# Altium project Battman.PrjPcb (part 2 of 2)

## Sheet RTCC.SchDoc
size A; SheetNumber: 10
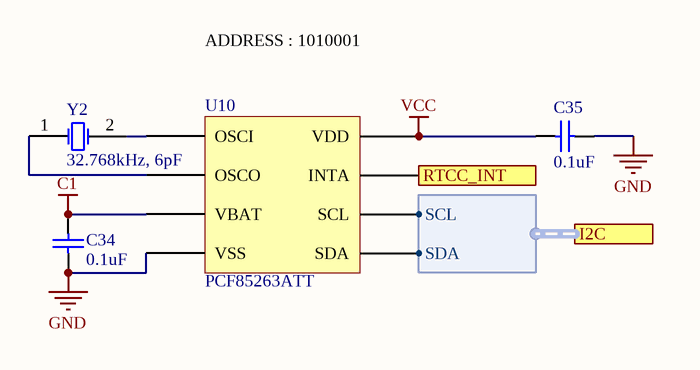
[diagram p5: RTCC.SchDoc]

### Parts
C34  value 0.1uF  [C0603[1608X92]]  (hidden comment: 0.1uF 6.3V 0603)
C35  value 0.1uF  [C0603[1608X92]]  (hidden comment: 0.1uF 6.3V 0603)
U10  PCF85263ATT  [TSSOP-8]
Y2  32.768kHz, 6pF  [ST3215SB]

### Ports
I2C (harness I2C), RTCC_INT (out)

### Harnesses
I2C: SCL, SDA

### Nets
C1: C34.2 U10.3(VBAT)
GND: C34.1 C35.2 U10.4(VSS)
VCC: C35.1 U10.8(VDD)
I2C_SYS.SCL: U10.6(SCL) ; port I2C.SCL
I2C_SYS.SDA: U10.5(SDA) ; port I2C.SDA
RTCC_INT: U10.7(INTA) ; port RTCC_INT
NetU10_1: U10.1(OSCI) Y2.2(X2)
NetU10_2: U10.2(OSCO) Y2.1(X1)

### Notes on the sheet
- ADDRESS : 1010001

### Library data of the parts
C34 C35 = CAP_0.1uF_6.3V_0603_10%: 0.1uF 6.3V 10% 0603 (1608 Metric); PartNumber: GRM188R70J104KA01D; Manufacturer: Murata; Mounting Technology: Surface Mount; PackageReference: 0603; PackageDescription: 0603 (1608 Metric); Voltage: 6.3V; Tolerance: 10%
U10 = PCF85263ATT: Real Time Clock Real-Time Clock calendar; PartNumber: PCF85263ATT/AJ; Manufacturer: Texas Instruments; Mounting Technology: Surface Mount; PackageReference: TSSOP-8
Y2 = ST3215SB32768B0HPWB3: 32.768kHz ±20ppm Crystal 6pF 60 kOhm -40°C ~ 85°C Surface Mount 2-SMD, No Lead (DFN, LCC); Manufacturer: AVX/Kyocera; PackageDescription: 2-SMD, No Lead (DFN, LCC); PackageReference: ST3215SB; Mounting Technology: Surface Mount; PartNumber: ST3215SB32768B0HPWB3

## Sheet Charging.SchDoc
size A; SheetNumber: 6
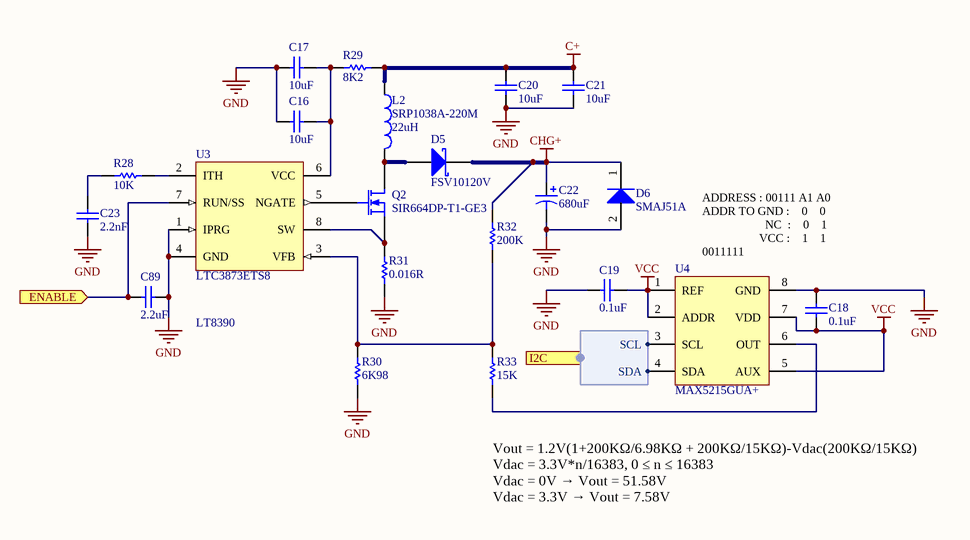
[diagram p6: Charging.SchDoc]

### Parts
(Parts that share a designator on the sheet are numbered #1, #2 ... from top to bottom, then left to right.)
C16  value 10uF  [C0603[1608X92]]  (hidden comment: 10uF 16V 0603)
C17  value 10uF  [C0603[1608X92]]  (hidden comment: 10uF 16V 0603)
C18  value 0.1uF  [C0603[1608X92]]  (hidden comment: 0.1uF 6.3V 0603)
C19  value 0.1uF  [C0603[1608X92]]  (hidden comment: 0.1uF 6.3V 0603)
C20#2  value 10uF  [C1206[3216X160]]  (hidden comment: 10uF 50V 1206)
C21#2  value 10uF  [C1206[3216X160]]  (hidden comment: 10uF 50V 1206)
C22  value 680uF  [CAP-ELECTROLYTIC[10.0x12.6]]  (hidden comment: 180uF 50V)
C23  value 2.2nF  [C0603[1608X92]]  (hidden comment: 2.2nF 50V 0603)
C89  value 2.2uF  [C0603[1608X92]]  (hidden comment: 2.2uF 10V 0603)
D5  FSV10120V  [TO-277]
D6  SMAJ51A  [DO-214AC]
L2  SRP1038A-220M  value 22uH  [SRP1038A]
Q2  SIR664DP-T1-GE3  [PowerPak-8]
R28  value 10K  [R0603[1608]]  (hidden comment: 10K 1% 0603)
R29  value 8K2  [R0603[1608]]  (hidden comment: 8K2 1% 0603)
R30  value 6K98  [R0603[1608]]  (hidden comment: 6K98 1% 0603)
R31  value 0.016R  [R1206[3216]]  (hidden comment: 0.016R 1% 1206)
R32  value 200K  [R0603[1608]]  (hidden comment: 200K 1% 0603)
R33  value 15K  [R0603[1608]]  (hidden comment: 15K 1% 0603)
U3  LTC3873ETS8  [SOT-23-8]
U4  MAX5215GUA+  [MSOP-8]

### Ports
ENABLE (in), I2C (harness I2C)

### Harnesses
I2C: SCL, SDA

### Nets
C+: C20#2.2 C21#2.2 L2.1 R29.2
CHG+: C22.1 D5.1(K) D6.1(K) R32.2
GND: C16.1 C17.1 C18.1 C19.2 C20#2.1 C21#2.1 C22.2 C23.1 C89.2 D6.2(A) R30.1 R31.1 U3.1(IPRG) U3.4(GND) U4.8(GND)
VCC: C18.2 C19.1 U4.1(REF) U4.2(ADDR) U4.5(AUX) U4.7(VDD)
BOOST: C89.1 U3.7(RUN/SS) ; port ENABLE
I2C_SYS.SCL: U4.3(SCL) ; port I2C.SCL
I2C_SYS.SDA: U4.4(SDA) ; port I2C.SDA
NetC16_2: C16.2 C17.2 R29.1 U3.6(VCC)
NetC23_2: C23.2 R28.1
NetD5_2: D5.2(A) L2.2 Q2.3(D)
NetQ2_1: Q2.1(S) R31.2 U3.8(SW)
NetQ2_2: Q2.2(G) U3.5(NGATE)
NetR28_2: R28.2 U3.2(ITH)
NetR30_2: R30.2 R32.1 R33.2 U3.3(VFB)
NetR33_1: R33.1 U4.6(OUT)

### Notes on the sheet
- ADDRESS : 00111 A1 A0
  ADDR TO GND :    0    0
  NC  :    0    1
  VCC :    1    1
  0011111
- LT8390
- Vout = 1.2V(1+200KΩ/6.98KΩ + 200KΩ/15KΩ)-Vdac(200KΩ/15KΩ)
  Vdac = 3.3V*n/16383, 0 ≤ n ≤ 16383
  Vdac = 0V → Vout = 51.58V
  Vdac = 3.3V → Vout = 7.58V

### Library data of the parts
C16 C17 = CAP_10uF_16V_0603_10%: 10uF 16V 10% 0603 (1608 Metric); PartNumber: GRM188R61C106KAALD; Manufacturer: Murata; TemperatureCoefficient: X5R; Mounting Technology: Surface Mount; PackageReference: 0603; PackageDescription: 0603 (1608 Metric); Voltage: 16V; Tolerance: 10%
C18 C19 = CAP_0.1uF_6.3V_0603_10%: as C34 on sheet RTCC; Mounting Technology: Surface Mount; PackageReference: 0603; PackageDescription: 0603 (1608 Metric); Voltage: 6.3V; Tolerance: 10%
C20#2 C21#2 = CAP_10uF_50V_1206_20%: 10uF 50V 20% 1206 (3216 Metric); PartNumber: UMK316BBJ106ML-T; Manufacturer: Taiyo Yuden; Tolerance: 20%; Mounting Technology: Surface Mount; PackageReference: 1206; PackageDescription: 1206 (3216 Metric); Voltage: 50V
C22 = CAP_180uF_50V_20%: 180uF 50V 20%; PartNumber: PCR1H181MCL1GS; Manufacturer: Nichicon; PackageReference: 1H; PackageDescription: 5mm; Mounting Technology: Surface Mount; Voltage: 50V; Tolerance: 20%
C23 = CAP_2.2nF_50V_0603_5%: 2.2nF 50V 5% 0603 (1608 Metric); PartNumber: GRM1885C1H222JA01D; Manufacturer: Murata; TemperatureCoefficient: C0G; Mounting Technology: Surface Mount; PackageReference: 0603; PackageDescription: 0603 (1608 Metric); Voltage: 50V; Tolerance: 5%
C89 = CAP_2.2uF_10V_0603_10%: 2.2uF 10V 10% 0603 (1608 Metric); PartNumber: GRT188R61A225KE13D; Manufacturer: Murata; TemperatureCoefficient: X5R; Mounting Technology: Surface Mount; PackageReference: 0603; PackageDescription: 0603 (1608 Metric); Voltage: 10V; Tolerance: 10%
D5 = FSV10120V: Schottky Diodes & Rectifiers 10 Amp 120V Schottky Rectifier; Manufacturer: Fairchild Semiconductor; PackageReference: TO-277-3; PartNumber: FSV10120V; Mounting Technology: Surface Mount
D6 = SMAJ51A-E3/61: Manufacturer: Vishay; PartNumber: SMAJ51A-E3/61; PackageReference: DO-214AC; PackageDescription: DO-214AC, 2 Leads; Mounting Technology: Surface Mount
L2 = SRP1038A-220M: 22uH 20% 7A 1038; Manufacturer: Bourns; PackageReference: SRP1038A; PartNumber: SRP1038A-220M; Mounting Technology: Surface Mount; Current: 7A
Q2 = SIR664DP-T1-GE3: N-Channel MOSFET; Manufacturer: Vishay; PartNumber: SIR664DP-T1-GE3; Mounting Technology: Surface Mount; PackageReference: PowerPAK-8
R28 = RES_10K_0603_1%: 10K 0.25W 1% 0603 (1005 Metric); Manufacturer: Vishay / Dale; PartNumber: CRCW060310K0FKEAHP; Tolerance: 1%; Power: 0.25W; Mounting Technology: Surface Mount; PackageReference: 0603; PackageDescription: 0603 (1608 Metric); ComponentLink1Description: Datasheet; ComponentLink1URL: http://www.vishay.com/docs/20065/rcse3.pdf
R29 = RES_8K2_0603_1%: 8K2 0.25W 1% 0603 (1005 Metric); Manufacturer: Vishay; PartNumber: CRCW06038K20FKEAHP; Tolerance: 1%; Power: 0.25W; Mounting Technology: Surface Mount; PackageReference: 0603; PackageDescription: 0603 (1608 Metric); ComponentLink1Description: Datasheet; ComponentLink1URL: http://www.vishay.com/docs/20043/crcwhpe3.pdf
R30 = RES_6K98_0603_1%: 6K98 0.25W 1% 0603 (1005 Metric); Manufacturer: Vishay / Dale; PartNumber: CRCW06036K98FKEAHP; Tolerance: 1%; Power: 0.25W; Mounting Technology: Surface Mount; PackageReference: 0603; PackageDescription: 0603 (1608 Metric); ComponentLink1Description: Datasheet; ComponentLink1URL: http://www.vishay.com/docs/20043/crcwhpe3.pdf
R31 = RES_0.016R_1206_1%: 0.016R 1W 1% 1206 (3216 Metric); Manufacturer: Panasonic; PartNumber: ERJ-8CWFR016V; Power: 1W; Tolerance: 1%; Mounting Technology: Surface Mount; PackageReference: 1206; PackageDescription: 1206 (3216 Metric); ComponentLink1Description: Datasheet; ComponentLink1URL: https://industrial.panasonic.com/cdbs/www-data/pdf/RDA0000/AOA0000C239.pdf
R32 = RES_200K_0603_1%: 200K 0.25W 1% 0603 (1005 Metric); Manufacturer: Rohm Semiconductor; PartNumber: ESR03EZPJ204; Tolerance: 5%; Power: 0.25W; Mounting Technology: Surface Mount; PackageReference: 0603; PackageDescription: 0603 (1608 Metric); ComponentLink1Description: Datasheet; ComponentLink1URL: http://www.vishay.com/docs/20043/crcwhpe3.pdf
R33 = RES_15K_0603_1%: 15K 0.25W 1% 0603 (1005 Metric); Manufacturer: Vishay / Dale; PartNumber: CRCW060315K0FKEAHP; Tolerance: 1%; Power: 0.25W; Mounting Technology: Surface Mount; PackageReference: 0603; PackageDescription: 0603 (1608 Metric); ComponentLink1Description: Datasheet; ComponentLink1URL: http://www.vishay.com/docs/20043/crcwhpe3.pdf
U3 = LTC3873ETS8: PartNumber: LTC3873ETS8#PBF; Manufacturer: Linear Technology; PackageReference: TSOT-23-8; Mounting Technology: Surface Mount
U4 = MAX5215GUA+: 14 Bit Digital to Analog Converter; Manufacturer: Maxim Integrated; PartNumber: MAX5215GUA+; Mounting Technology: Surface Mount; PackageReference: MSOP-8

## Sheet CurrentSense.SchDoc
size A; SheetNumber: 8
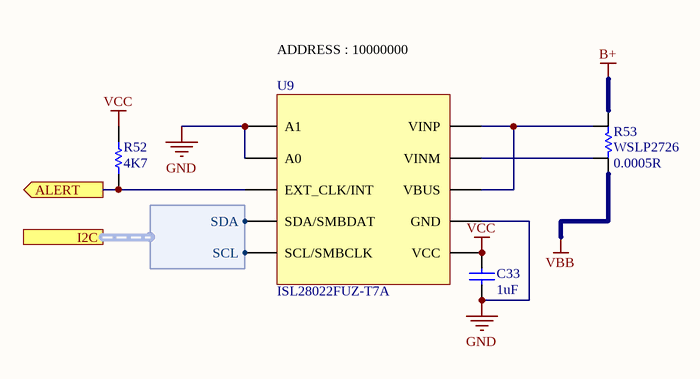
[diagram p7: CurrentSense.SchDoc]

### Parts
C33  value 1uF  [C0603[1608X92]]  (hidden comment: 1uF 6.3V 0603)
R52  value 4K7  [R0603[1608]]  (hidden comment: 4K7 1% 0603)
R53  WSLP2726  value 0.0005R  [WSL2726]
U9  ISL28022FUZ-T7A  [MSOP-10]

### Ports
ALERT (out), I2C (harness I2C)

### Harnesses
I2C: SCL, SDA

### Nets
B+: R53.2
GND: C33.1 U9.1(A1) U9.2(A0) U9.7(GND)
VBB: R53.1
VCC: C33.2 R52.2 U9.6(VCC)
ALERT: R52.1 U9.3(EXT_CLK/INT) ; port ALERT
I2C_SYS.SCL: U9.5(SCL/SMBCLK) ; port I2C.SCL
I2C_SYS.SDA: U9.4(SDA/SMBDAT) ; port I2C.SDA
NetR53_3: R53.3 U9.9(VINM)
NetR53_4: R53.4 U9.8(VBUS) U9.10(VINP)

### Notes on the sheet
- ADDRESS : 10000000

### Library data of the parts
C33 = CAP_1uF_6.3V_0603_10%: 1uF 6.3V 10% 0603 (1608 Metric); PartNumber: GRM188R60J105KA01D; Manufacturer: Murata; TemperatureCoefficient: X5R; Mounting Technology: Surface Mount; PackageReference: 0603; PackageDescription: 0603 (1608 Metric); Voltage: 6.3V; Tolerance: 10%
R52 = RES_4K7_0603_1%: 4K7 0.25W 1% 0603 (1005 Metric); Manufacturer: Vishay / Dale; PartNumber: CRCW06034K70FKEAHP; Tolerance: 1%; Power: 0.25W; Mounting Technology: Surface Mount; PackageReference: 0603; PackageDescription: 0603 (1608 Metric); ComponentLink1Description: Datasheet; ComponentLink1URL: http://www.vishay.com/docs/20043/crcwhpe3.pdf
R53 = WSLP2726: Current Sense Resistor, 0.0005R; PartNumber: WSLP2726L5000FEA; Manufacturer: Vishay / Dale; Power: 7W; Tolerance: 1%; PackageReference: 2726; Mounting Technology: Surface Mount
U9 = ISL28022FUZ-T7A: Manufacturer: Intersil; PartNumber: ISL28022FUZ-T7A; Mounting Technology: Surface Mount; PackageReference: MSOP-10

## Sheet LTC6803.SchDoc
size A; SheetNumber: 4
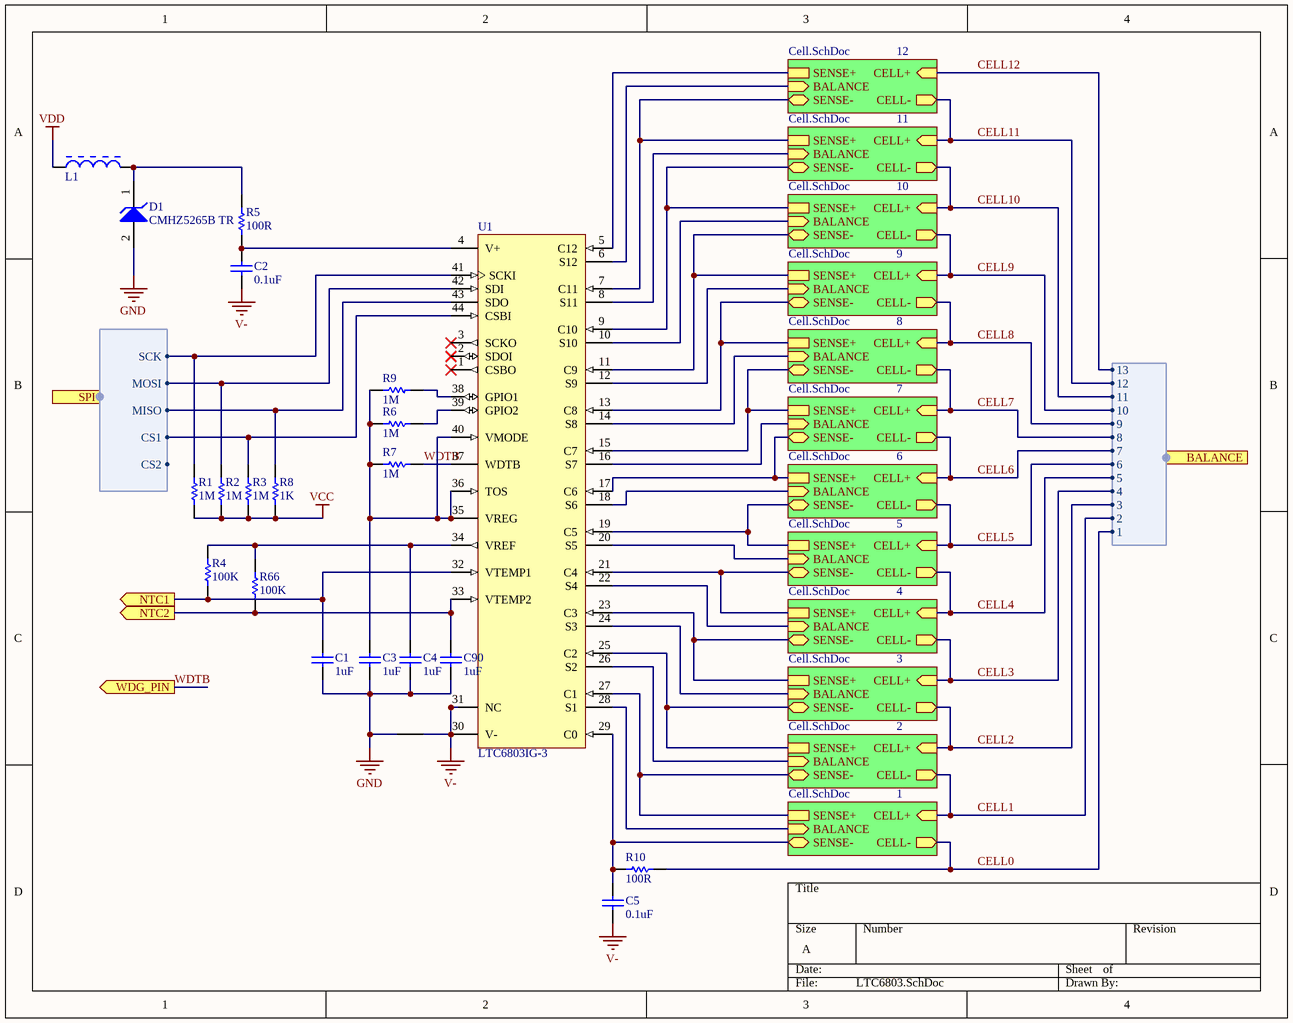
[diagram p8: LTC6803.SchDoc]

### Parts
*  NetTie  [NetTie]  (value not drawn)  (net tie, no BOM)
C1  value 1uF  [C0603[1608X92]]  (hidden comment: 1uF 6.3V 0603)
C2  value 0.1uF  [C0603[1608X92]]  (hidden comment: 0.1uF 100V 0603)
C3  value 1uF  [C0603[1608X92]]  (hidden comment: 1uF 6.3V 0603)
C4  value 1uF  [C0603[1608X92]]  (hidden comment: 1uF 6.3V 0603)
C5  value 0.1uF  [C0603[1608X92]]  (hidden comment: 0.1uF 6.3V 0603)
C90  value 1uF  [C0603[1608X92]]  (hidden comment: 1uF 6.3V 0603)
D1  CMHZ5265B TR  [SOD-123]
L1  MURA-FB-2  [MURA-BLM31-B60-CHIP-2_V3]  (value not drawn)
R1  value 1M  [R0603[1608]]  (hidden comment: 1M 5% 0603)
R2  value 1M  [R0603[1608]]  (hidden comment: 1M 5% 0603)
R3  value 1M  [R0603[1608]]  (hidden comment: 1M 5% 0603)
R4  value 100K  [R0603[1608]]  (hidden comment: 100K 1% 0603)
R5  value 100R  [R0603[1608]]  (hidden comment: 100R 1% 0603)
R6  value 1M  [R0603[1608]]  (hidden comment: 1M 5% 0603)
R7  value 1M  [R0603[1608]]  (hidden comment: 1M 5% 0603)
R8  value 1K  [R0603[1608]]  (hidden comment: 1K 1% 0603)
R9  value 1M  [R0603[1608]]  (hidden comment: 1M 5% 0603)
R10  value 100R  [R0603[1608]]  (hidden comment: 100R 1% 0603)
R66  value 100K  [R0603[1608]]  (hidden comment: 100K 1% 0603)
U1  LTC6803IG-3  [TSSOP-44]

### Sub-sheets
1 = Cell.SchDoc: SENSE+, SENSE- (bidir), BALANCE (in), CELL+ (in), CELL- (out)
2 = Cell.SchDoc: SENSE+, SENSE- (bidir), BALANCE (in), CELL+ (in), CELL- (out)
3 = Cell.SchDoc: SENSE+, SENSE- (bidir), BALANCE (in), CELL+ (in), CELL- (out)
4 = Cell.SchDoc: SENSE+, SENSE- (bidir), BALANCE (in), CELL+ (in), CELL- (out)
5 = Cell.SchDoc: SENSE+, SENSE- (bidir), BALANCE (in), CELL+ (in), CELL- (out)
6 = Cell.SchDoc: SENSE+, SENSE- (bidir), BALANCE (in), CELL+ (in), CELL- (out)
7 = Cell.SchDoc: SENSE+, SENSE- (bidir), BALANCE (in), CELL+ (in), CELL- (out)
8 = Cell.SchDoc: SENSE+, SENSE- (bidir), BALANCE (in), CELL+ (in), CELL- (out)
9 = Cell.SchDoc: SENSE+, SENSE- (bidir), BALANCE (in), CELL+ (in), CELL- (out)
10 = Cell.SchDoc: SENSE+, SENSE- (bidir), BALANCE (in), CELL+ (in), CELL- (out)
11 = Cell.SchDoc: SENSE+, SENSE- (bidir), BALANCE (in), CELL+ (in), CELL- (out)
12 = Cell.SchDoc: SENSE+, SENSE- (bidir), BALANCE (in), CELL+ (in), CELL- (out)

### Ports
BALANCE (harness Balance), NTC1 (out), NTC2 (out), SPI (harness SPI), WDG_PIN (out)

### Harnesses
SPI: SCK, MOSI, MISO, CS1, CS2
Balance: 13, 12, 11, 10, 9, 8, 6, 7, 5, 3, 4, 2, 1

### Nets
GND: *.1 C1.1 C3.1 C4.1 C90.1 D1.2(A)
V-: *.2 C2.1 C5.1 U1.30(V-) U1.31(NC)
VCC: R1.1 R2.1 R3.1 R8.1
VDD: L1.1
CELL0: R10.1 ; sheet 1/CELL-, port BALANCE.1
CELL1: sheet 2/CELL-, sheet 1/CELL+, port BALANCE.2
CELL2: sheet 3/CELL-, sheet 2/CELL+, port BALANCE.3
CELL3: sheet 4/CELL-, sheet 3/CELL+, port BALANCE.4
CELL4: sheet 5/CELL-, sheet 4/CELL+, port BALANCE.5
CELL5: sheet 6/CELL-, sheet 5/CELL+, port BALANCE.6
CELL6: sheet 7/CELL-, sheet 6/CELL+, port BALANCE.7
CELL7: sheet 8/CELL-, sheet 7/CELL+, port BALANCE.8
CELL8: sheet 9/CELL-, sheet 8/CELL+, port BALANCE.9
CELL9: sheet 10/CELL-, sheet 9/CELL+, port BALANCE.10
CELL10: sheet 11/CELL-, sheet 10/CELL+, port BALANCE.11
CELL11: sheet 12/CELL-, sheet 11/CELL+, port BALANCE.12
CELL12: sheet 12/CELL+, port BALANCE.13
SPI_SYS.CS1: R3.2 U1.44(CSBI) ; port SPI.CS1
SPI_SYS.MISO: R8.2 U1.43(SDO) ; port SPI.MISO
SPI_SYS.MOSI: R2.2 U1.42(SDI) ; port SPI.MOSI
SPI_SYS.SCK: R1.2 U1.41(SCKI) ; port SPI.SCK
WDTB: R7.1 U1.37(WDTB) ; port WDG_PIN
NetC1_2: C1.2 R4.1 U1.32(VTEMP1) ; port NTC1
NetC2_2: C2.2 R5.1 U1.4(V+)
NetC3_2: C3.2 R6.2 R7.2 R9.2 U1.35(VREG) U1.36(TOS) U1.40(VMODE)
NetC4_2: C4.2 R4.2 R66.2 U1.34(VREF)
NetC5_2: C5.2 R10.2 U1.29(C0) ; sheet 1/SENSE-
NetC23_1_2: U1.27(C1) ; sheet 2/SENSE-, sheet 1/SENSE+
NetC23_2_2: U1.25(C2) ; sheet 3/SENSE-, sheet 2/SENSE+
NetC23_3_2: U1.23(C3) ; sheet 4/SENSE-, sheet 3/SENSE+
NetC23_4_2: U1.21(C4) ; sheet 5/SENSE-, sheet 4/SENSE+
NetC23_5_2: U1.19(C5) ; sheet 6/SENSE-, sheet 5/SENSE+
NetC23_6_2: U1.17(C6) ; sheet 7/SENSE-, sheet 6/SENSE+
NetC23_7_2: U1.15(C7) ; sheet 8/SENSE-, sheet 7/SENSE+
NetC23_8_2: U1.13(C8) ; sheet 9/SENSE-, sheet 8/SENSE+
NetC23_9_2: U1.11(C9) ; sheet 10/SENSE-, sheet 9/SENSE+
NetC23_10_2: U1.9(C10) ; sheet 11/SENSE-, sheet 10/SENSE+
NetC23_11_2: U1.7(C11) ; sheet 12/SENSE-, sheet 11/SENSE+
NetC23_12_2: U1.5(C12) ; sheet 12/SENSE+
NetC90_2: C90.2 R66.1 U1.33(VTEMP2) ; port NTC2
NetD1_1: D1.1(K) L1.2 R5.2
NetQ3_1_1: U1.28(S1) ; sheet 1/BALANCE
NetQ3_2_1: U1.26(S2) ; sheet 2/BALANCE
NetQ3_3_1: U1.24(S3) ; sheet 3/BALANCE
NetQ3_4_1: U1.22(S4) ; sheet 4/BALANCE
NetQ3_5_1: U1.20(S5) ; sheet 5/BALANCE
NetQ3_6_1: U1.18(S6) ; sheet 6/BALANCE
NetQ3_7_1: U1.16(S7) ; sheet 7/BALANCE
NetQ3_8_1: U1.14(S8) ; sheet 8/BALANCE
NetQ3_9_1: U1.12(S9) ; sheet 9/BALANCE
NetQ3_10_1: U1.10(S10) ; sheet 10/BALANCE
NetQ3_11_1: U1.8(S11) ; sheet 11/BALANCE
NetQ3_12_1: U1.6(S12) ; sheet 12/BALANCE
NetR6_1: R6.1 U1.39(GPIO2)
NetR9_1: R9.1 U1.38(GPIO1)

Not connected (* = marked no-connect by the designer): U1 1(CSBO)* 2(SDOI)* 3(SCKO)*

### Library data of the parts
C1 C3 C4 C90 = CAP_1uF_6.3V_0603_10%: as C33 on sheet CurrentSense; Mounting Technology: Surface Mount; PackageReference: 0603; PackageDescription: 0603 (1608 Metric); Voltage: 6.3V; Tolerance: 10%
C2 = CAP_0.1uF_100V_0603_10%: as C38 on sheet Switches; Mounting Technology: Surface Mount; PackageReference: 0603; PackageDescription: 0603 (1608 Metric); Voltage: 100V; Tolerance: 10%
C5 = CAP_0.1uF_6.3V_0603_10%: as C34 on sheet RTCC; Mounting Technology: Surface Mount; PackageReference: 0603; PackageDescription: 0603 (1608 Metric); Voltage: 6.3V; Tolerance: 10%
D1 = CMHZ5265B: Zener Diodes 500mW Zener Diode 185mA 58.9V to 2V; Manufacturer: Central Semiconductor; PartNumber: CMHZ5265B; Mounting Technology: Surface Mount; PackageReference: SOD-123; PackageDescription: SOD, 2-Leads, Body 2.69x1.6mm
L1 = MURA-FB-2: EMI Filter Beads, Chips & Arrays 1206 33 OHM; PartNumber: BLM31PG330SN1L; Manufacturer: Murata; Mounting Technology: Surface Mount; PackageReference: 1206; PackageDescription: 1206 (3216 Metric)
R1-R3 R6 R7 R9 = RES_1M_0603_5%: 1M 0.25W 5% 0603 (1005 Metric); Manufacturer: Panasonic; PartNumber: ERJ-PA3J105V; Tolerance: 5%; Power: 0.25W; Mounting Technology: Surface Mount; PackageReference: 0603; PackageDescription: 0603 (1608 Metric); ComponentLink1Description: Datasheet; ComponentLink1URL: http://www.vishay.com/docs/20043/crcwhpe3.pdf
R4 R66 = RES_100K_0603_1%: 100K 0.25W 1% 0603 (1005 Metric); Manufacturer: Vishay / Dale; PartNumber: CRCW0603100KFKEAHP; Tolerance: 1%; Power: 0.25W; Mounting Technology: Surface Mount; PackageReference: 0603; PackageDescription: 0603 (1608 Metric); ComponentLink1Description: Datasheet; ComponentLink1URL: http://www.vishay.com/docs/20043/crcwhpe3.pdf
R5 R10 = RES_100R_0603_1%: as R50 on sheet Switches; Tolerance: 1%; Power: 0.25W; Mounting Technology: Surface Mount; PackageReference: 0603; PackageDescription: 0603 (1608 Metric); ComponentLink1Description: Datasheet; ComponentLink1URL: http://www.vishay.com/docs/20043/crcwhpe3.pdf
R8 = RES_1K_0603_1%: 1K 0.25W 1% 0603 (1005 Metric); Manufacturer: Vishay / Dale; PartNumber: CRCW06031K00FKEAHP; Tolerance: 1%; Power: 0.25W; Mounting Technology: Surface Mount; PackageReference: 0603; PackageDescription: 0603 (1608 Metric); ComponentLink1Description: Datasheet; ComponentLink1URL: http://www.vishay.com/docs/20043/crcwhpe3.pdf
U1 = LTC6803IG-3: PartNumber: LTC6803IG-3#PBF; Manufacturer: Linear Technology; PackageReference: TSSOP-44; Mounting Technology: Surface Mount; PackageDescription: SOP, 44-Leads, Body 13.1x5.6mm, Pitch 0.5mm

## Sheet Cell.SchDoc
size A; SheetNumber: 5
Used 12 times, as channels U_LTC6803/12, U_LTC6803/11, U_LTC6803/10, U_LTC6803/9, U_LTC6803/8, U_LTC6803/7, U_LTC6803/6, U_LTC6803/5, U_LTC6803/4, U_LTC6803/3, U_LTC6803/2, U_LTC6803/1. Parts and nets are listed once, with the designators drawn on the sheet.
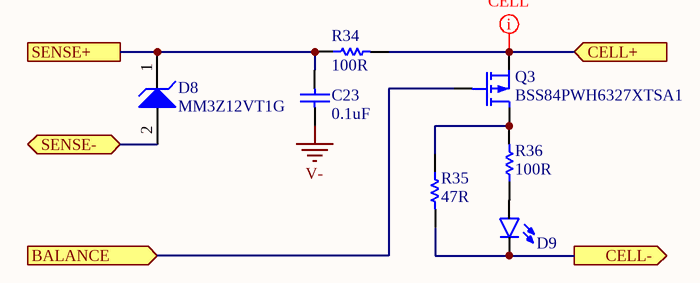
[diagram p9: Cell.SchDoc]

### Parts
C23  value 0.1uF  [C0603[1608X92]]  (hidden comment: 0.1uF 100V 0603)
D8  MM3Z12VT1G  [SOD-323]
D9  LED_0603_BLUE_5mA  [LED0603]  (value not drawn)
Q3  BSS84PWH6327XTSA1  [SOT323-3]
R34  value 100R  [R0603[1608]]  (hidden comment: 100R 1% 0603)
R35  value 47R  [R0805[2012]]  (hidden comment: 47R 5% 0805)
R36  value 100R  [R0603[1608]]  (hidden comment: 100R 1% 0603)

### Ports
BALANCE (in), CELL+ (in), CELL- (out), SENSE+, SENSE- (bidir)

### Nets
V-: C23.1
BALANCE: Q3.1(G) ; port BALANCE
CELL+: Q3.2(S) R34.1 ; port CELL+
CELL-: D9.C R35.1 ; port CELL-
SENSE+: C23.2 D8.1(K) R34.2 ; port SENSE+
SENSE-: D8.2(A) ; port SENSE-
NetD9_A: D9.A R36.2
NetQ3_3: Q3.3(D) R35.2 R36.1

### Channels
U_LTC6803/12: designators end in _12; ports BALANCE=NetQ3_12_1 CELL+=CELL12 CELL-=CELL11 SENSE+=NetC23_12_2 SENSE-=NetC23_11_2
U_LTC6803/11: designators end in _11; ports BALANCE=NetQ3_11_1 CELL+=CELL11 CELL-=CELL10 SENSE+=NetC23_11_2 SENSE-=NetC23_10_2
U_LTC6803/10: designators end in _10; ports BALANCE=NetQ3_10_1 CELL+=CELL10 CELL-=CELL9 SENSE+=NetC23_10_2 SENSE-=NetC23_9_2
U_LTC6803/9: designators end in _9; ports BALANCE=NetQ3_9_1 CELL+=CELL9 CELL-=CELL8 SENSE+=NetC23_9_2 SENSE-=NetC23_8_2
U_LTC6803/8: designators end in _8; ports BALANCE=NetQ3_8_1 CELL+=CELL8 CELL-=CELL7 SENSE+=NetC23_8_2 SENSE-=NetC23_7_2
U_LTC6803/7: designators end in _7; ports BALANCE=NetQ3_7_1 CELL+=CELL7 CELL-=CELL6 SENSE+=NetC23_7_2 SENSE-=NetC23_6_2
U_LTC6803/6: designators end in _6; ports BALANCE=NetQ3_6_1 CELL+=CELL6 CELL-=CELL5 SENSE+=NetC23_6_2 SENSE-=NetC23_5_2
U_LTC6803/5: designators end in _5; ports BALANCE=NetQ3_5_1 CELL+=CELL5 CELL-=CELL4 SENSE+=NetC23_5_2 SENSE-=NetC23_4_2
U_LTC6803/4: designators end in _4; ports BALANCE=NetQ3_4_1 CELL+=CELL4 CELL-=CELL3 SENSE+=NetC23_4_2 SENSE-=NetC23_3_2
U_LTC6803/3: designators end in _3; ports BALANCE=NetQ3_3_1 CELL+=CELL3 CELL-=CELL2 SENSE+=NetC23_3_2 SENSE-=NetC23_2_2
U_LTC6803/2: designators end in _2; ports BALANCE=NetQ3_2_1 CELL+=CELL2 CELL-=CELL1 SENSE+=NetC23_2_2 SENSE-=NetC23_1_2
U_LTC6803/1: designators end in _1; ports BALANCE=NetQ3_1_1 CELL+=CELL1 CELL-=CELL0 SENSE+=NetC23_1_2 SENSE-=NetC5_2

### Layout directives
net class CELL: CELL12

### Library data of the parts
C23 = CAP_0.1uF_100V_0603_10%: 0.1uF 100V 10% 0603 (1608 Metric); PartNumber: GRM188R72A104KA35D; Manufacturer: Murata; TemperatureCoefficient: X7R; Mounting Technology: Surface Mount; PackageReference: 0603; PackageDescription: 0603 (1608 Metric); Voltage: 100V; Tolerance: 10%
D8 = MM3Z12VT1G: Zener Voltage Regulator, 300 mW, 2-Pin SOD-323, Tape and Reel; Manufacturer: ON Semiconductor; Mounting Technology: Surface Mount; PackageDescription: SOD, 2-Leads; PartNumber: MM3Z12VT1G; PackageReference: SOD-323
D9 = LED_0603_BLUE_5mA: PartNumber: LTST-C193TBKT-5A; Manufacturer: Lite-On Inc.; PackageReference: 0603; PackageDescription: 0603 (1608 Metric); Mounting Technology: Surface Mount
Q3 = BSS84PW H6327: P-Channel MOSFET; Manufacturer: Infineon; Mounting Technology: Surface Mount; PartNumber: BSS84PWH6327XTSA1; PackageReference: SOT323-3
R34 R36 = RES_100R_0603_1%: 100R 0.25W 1% 0603 (1005 Metric); Manufacturer: Vishay / Dale; PartNumber: CRCW0603100RFKEAHP; Tolerance: 1%; Power: 0.25W; Mounting Technology: Surface Mount; PackageReference: 0603; PackageDescription: 0603 (1608 Metric); ComponentLink1Description: Datasheet; ComponentLink1URL: http://www.vishay.com/docs/20043/crcwhpe3.pdf
R35 = RES_47R_0805_5%: 47R 0.5W 5% 0805 (2012 Metric); Manufacturer: Panasonic; PartNumber: ERJ-P06J470V; Tolerance: 5%; Power: 0.5W; Mounting Technology: Surface Mount; PackageReference: 0805; PackageDescription: 0805 (2012 Metric); ComponentLink1Description: Datasheet; ComponentLink1URL: https://industrial.panasonic.com/cdbs/www-data/pdf/RDA0000/AOA0000C243.pdf

## Nets that join several sheets
5V: 3V3 (5 pins), Connectors (JPB.1 JPB.3)
B+: Switches (D16.1), CurrentSense (R53.2)
C1: Switches (D18.1 Q9.2 R41.1), Connectors (*1.2), RTCC (C34.2 U10.3)
C+: Switches (R27.2 R38.2), Connectors (JP10.7), Charging (C20#2.2 C21#2.2 L2.1 R29.2)
CHG+: Switches (5 pins), Charging (C22.1 D5.1 D6.1 R32.2)
GND: 3V3 (18 pins), MCU (25 pins), Switches (19 pins), Connectors (19 pins), RTCC (C34.1 C35.2 U10.4), Charging (15 pins), CurrentSense (C33.1 U9.1 U9.2 U9.7), LTC6803 (6 pins)
SWT: Switches (5 pins), Connectors (JP4.1 JP21.1)
V-: LTC6803 (5 pins), U_LTC6803/12 (C23_12.1), U_LTC6803/11 (C23_11.1), U_LTC6803/10 (C23_10.1), U_LTC6803/9 (C23_9.1), U_LTC6803/8 (C23_8.1), U_LTC6803/7 (C23_7.1), U_LTC6803/6 (C23_6.1), U_LTC6803/5 (C23_5.1), U_LTC6803/4 (C23_4.1), U_LTC6803/3 (C23_3.1), U_LTC6803/2 (C23_2.1), U_LTC6803/1 (C23_1.1)
VBB: Switches (8 pins), CurrentSense (R53.1)
VCC: 3V3 (5 pins), MCU (30 pins), Switches (Q15.2 U7.5 U7.7), Connectors (11 pins), RTCC (C35.1 U10.8), Charging (6 pins), CurrentSense (C33.2 R52.2 U9.6), LTC6803 (R1.1 R2.1 R3.1 R8.1)
VDD: 3V3 (5 pins), Switches (Q7.3 R50.1), LTC6803 (L1.1)
VUSB: 3V3 (D11.2 D15.1), MCU (U2.68), Connectors (JP16.VBUS)
ALERT: MCU (U2.36), CurrentSense (R52.1 U9.3)
BOOST: MCU (U2.37), Charging (C89.1 U3.7)
CELL0: Connectors (JP1.1), LTC6803 (R10.1), U_LTC6803/1 (D9_1.C R35_1.1)
CELL1: Connectors (*1.1 JP1.2), U_LTC6803/2 (D9_2.C R35_2.1), U_LTC6803/1 (Q3_1.2 R34_1.1)
CELL2: Connectors (JP1.3), U_LTC6803/3 (D9_3.C R35_3.1), U_LTC6803/2 (Q3_2.2 R34_2.1)
CELL3: Connectors (JP1.4), U_LTC6803/4 (D9_4.C R35_4.1), U_LTC6803/3 (Q3_3.2 R34_3.1)
CELL4: Connectors (JP1.5), U_LTC6803/5 (D9_5.C R35_5.1), U_LTC6803/4 (Q3_4.2 R34_4.1)
CELL5: Connectors (JP1.6), U_LTC6803/6 (D9_6.C R35_6.1), U_LTC6803/5 (Q3_5.2 R34_5.1)
CELL6: Connectors (JP1.7), U_LTC6803/7 (D9_7.C R35_7.1), U_LTC6803/6 (Q3_6.2 R34_6.1)
CELL7: Connectors (JP1.8), U_LTC6803/8 (D9_8.C R35_8.1), U_LTC6803/7 (Q3_7.2 R34_7.1)
CELL8: Connectors (JP1.9), U_LTC6803/9 (D9_9.C R35_9.1), U_LTC6803/8 (Q3_8.2 R34_8.1)
CELL9: Connectors (JP1.10), U_LTC6803/10 (D9_10.C R35_10.1), U_LTC6803/9 (Q3_9.2 R34_9.1)
CELL10: Connectors (JP1.11), U_LTC6803/11 (D9_11.C R35_11.1), U_LTC6803/10 (Q3_10.2 R34_10.1)
CELL11: Connectors (JP1.12), U_LTC6803/12 (D9_12.C R35_12.1), U_LTC6803/11 (Q3_11.2 R34_11.1)
CELL12: Connectors (JP1.13), U_LTC6803/12 (Q3_12.2 R34_12.1)
I2C_SYS.SCL: RTCC (U10.6), Charging (U4.3), CurrentSense (U9.5)
I2C_SYS.SDA: RTCC (U10.5), Charging (U4.4), CurrentSense (U9.4)
IO_IRQ: MCU (U2.9), Connectors (JP13.6)
IO_RST: MCU (U2.8), Connectors (JP13.7)
LED_STRIP_L: MCU (U2.23), Connectors (JP13.3)
LED_STRIP_R: MCU (U2.22), Connectors (JP13.4)
MPU_INT1: MCU (U2.96), Connectors (JP13.11)
MPU_INT2: MCU (U2.95), Connectors (JP13.12)
NetC1_2: Connectors (JP2.4), LTC6803 (C1.2 R4.1 U1.32)
NetC5_2: LTC6803 (C5.2 R10.2 U1.29), U_LTC6803/1 (D8_1.2)
NetC23_1_2: LTC6803 (U1.27), U_LTC6803/2 (D8_2.2), U_LTC6803/1 (C23_1.2 D8_1.1 R34_1.2)
NetC23_2_2: LTC6803 (U1.25), U_LTC6803/3 (D8_3.2), U_LTC6803/2 (C23_2.2 D8_2.1 R34_2.2)
NetC23_3_2: LTC6803 (U1.23), U_LTC6803/4 (D8_4.2), U_LTC6803/3 (C23_3.2 D8_3.1 R34_3.2)
NetC23_4_2: LTC6803 (U1.21), U_LTC6803/5 (D8_5.2), U_LTC6803/4 (C23_4.2 D8_4.1 R34_4.2)
NetC23_5_2: LTC6803 (U1.19), U_LTC6803/6 (D8_6.2), U_LTC6803/5 (C23_5.2 D8_5.1 R34_5.2)
NetC23_6_2: LTC6803 (U1.17), U_LTC6803/7 (D8_7.2), U_LTC6803/6 (C23_6.2 D8_6.1 R34_6.2)
NetC23_7_2: LTC6803 (U1.15), U_LTC6803/8 (D8_8.2), U_LTC6803/7 (C23_7.2 D8_7.1 R34_7.2)
NetC23_8_2: LTC6803 (U1.13), U_LTC6803/9 (D8_9.2), U_LTC6803/8 (C23_8.2 D8_8.1 R34_8.2)
NetC23_9_2: LTC6803 (U1.11), U_LTC6803/10 (D8_10.2), U_LTC6803/9 (C23_9.2 D8_9.1 R34_9.2)
NetC23_10_2: LTC6803 (U1.9), U_LTC6803/11 (D8_11.2), U_LTC6803/10 (C23_10.2 D8_10.1 R34_10.2)
NetC23_11_2: LTC6803 (U1.7), U_LTC6803/12 (D8_12.2), U_LTC6803/11 (C23_11.2 D8_11.1 R34_11.2)
NetC23_12_2: LTC6803 (U1.5), U_LTC6803/12 (C23_12.2 D8_12.1 R34_12.2)
NetC90_2: Connectors (JP2.3), LTC6803 (C90.2 R66.1 U1.33)
NetJP4_2: Switches (R46.2), Connectors (JP4.2)
NetQ1_1: MCU (Q1.1), Switches (Q12.1 R46.1 R47.2)
NetQ3_1_1: LTC6803 (U1.28), U_LTC6803/1 (Q3_1.1)
NetQ3_2_1: LTC6803 (U1.26), U_LTC6803/2 (Q3_2.1)
NetQ3_3_1: LTC6803 (U1.24), U_LTC6803/3 (Q3_3.1)
NetQ3_4_1: LTC6803 (U1.22), U_LTC6803/4 (Q3_4.1)
NetQ3_5_1: LTC6803 (U1.20), U_LTC6803/5 (Q3_5.1)
NetQ3_6_1: LTC6803 (U1.18), U_LTC6803/6 (Q3_6.1)
NetQ3_7_1: LTC6803 (U1.16), U_LTC6803/7 (Q3_7.1)
NetQ3_8_1: LTC6803 (U1.14), U_LTC6803/8 (Q3_8.1)
NetQ3_9_1: LTC6803 (U1.12), U_LTC6803/9 (Q3_9.1)
NetQ3_10_1: LTC6803 (U1.10), U_LTC6803/10 (Q3_10.1)
NetQ3_11_1: LTC6803 (U1.8), U_LTC6803/11 (Q3_11.1)
NetQ3_12_1: LTC6803 (U1.6), U_LTC6803/12 (Q3_12.1)
NetR22_2: MCU (R22.2), Switches (U7.10)
POWER_GATE: MCU (U2.40), Switches (Q11.1 R45.2)
RTCC_INT: MCU (U2.39), Switches (Q9.1 R41.2), RTCC (U10.7)
USB_ID: MCU (U2.69), Connectors (JP16.ID)
USB_N: MCU (R11.1), Connectors (JP16.D-)
USB_P: MCU (R12.1), Connectors (JP16.D+)
WDTB: Switches (Q15.1), LTC6803 (R7.1 U1.37)